# EAGLE design ASD2202 (EAGLE 6.3)
DATABASE: ./../../../../../Components/TinyCircuits_Part_Database.txt
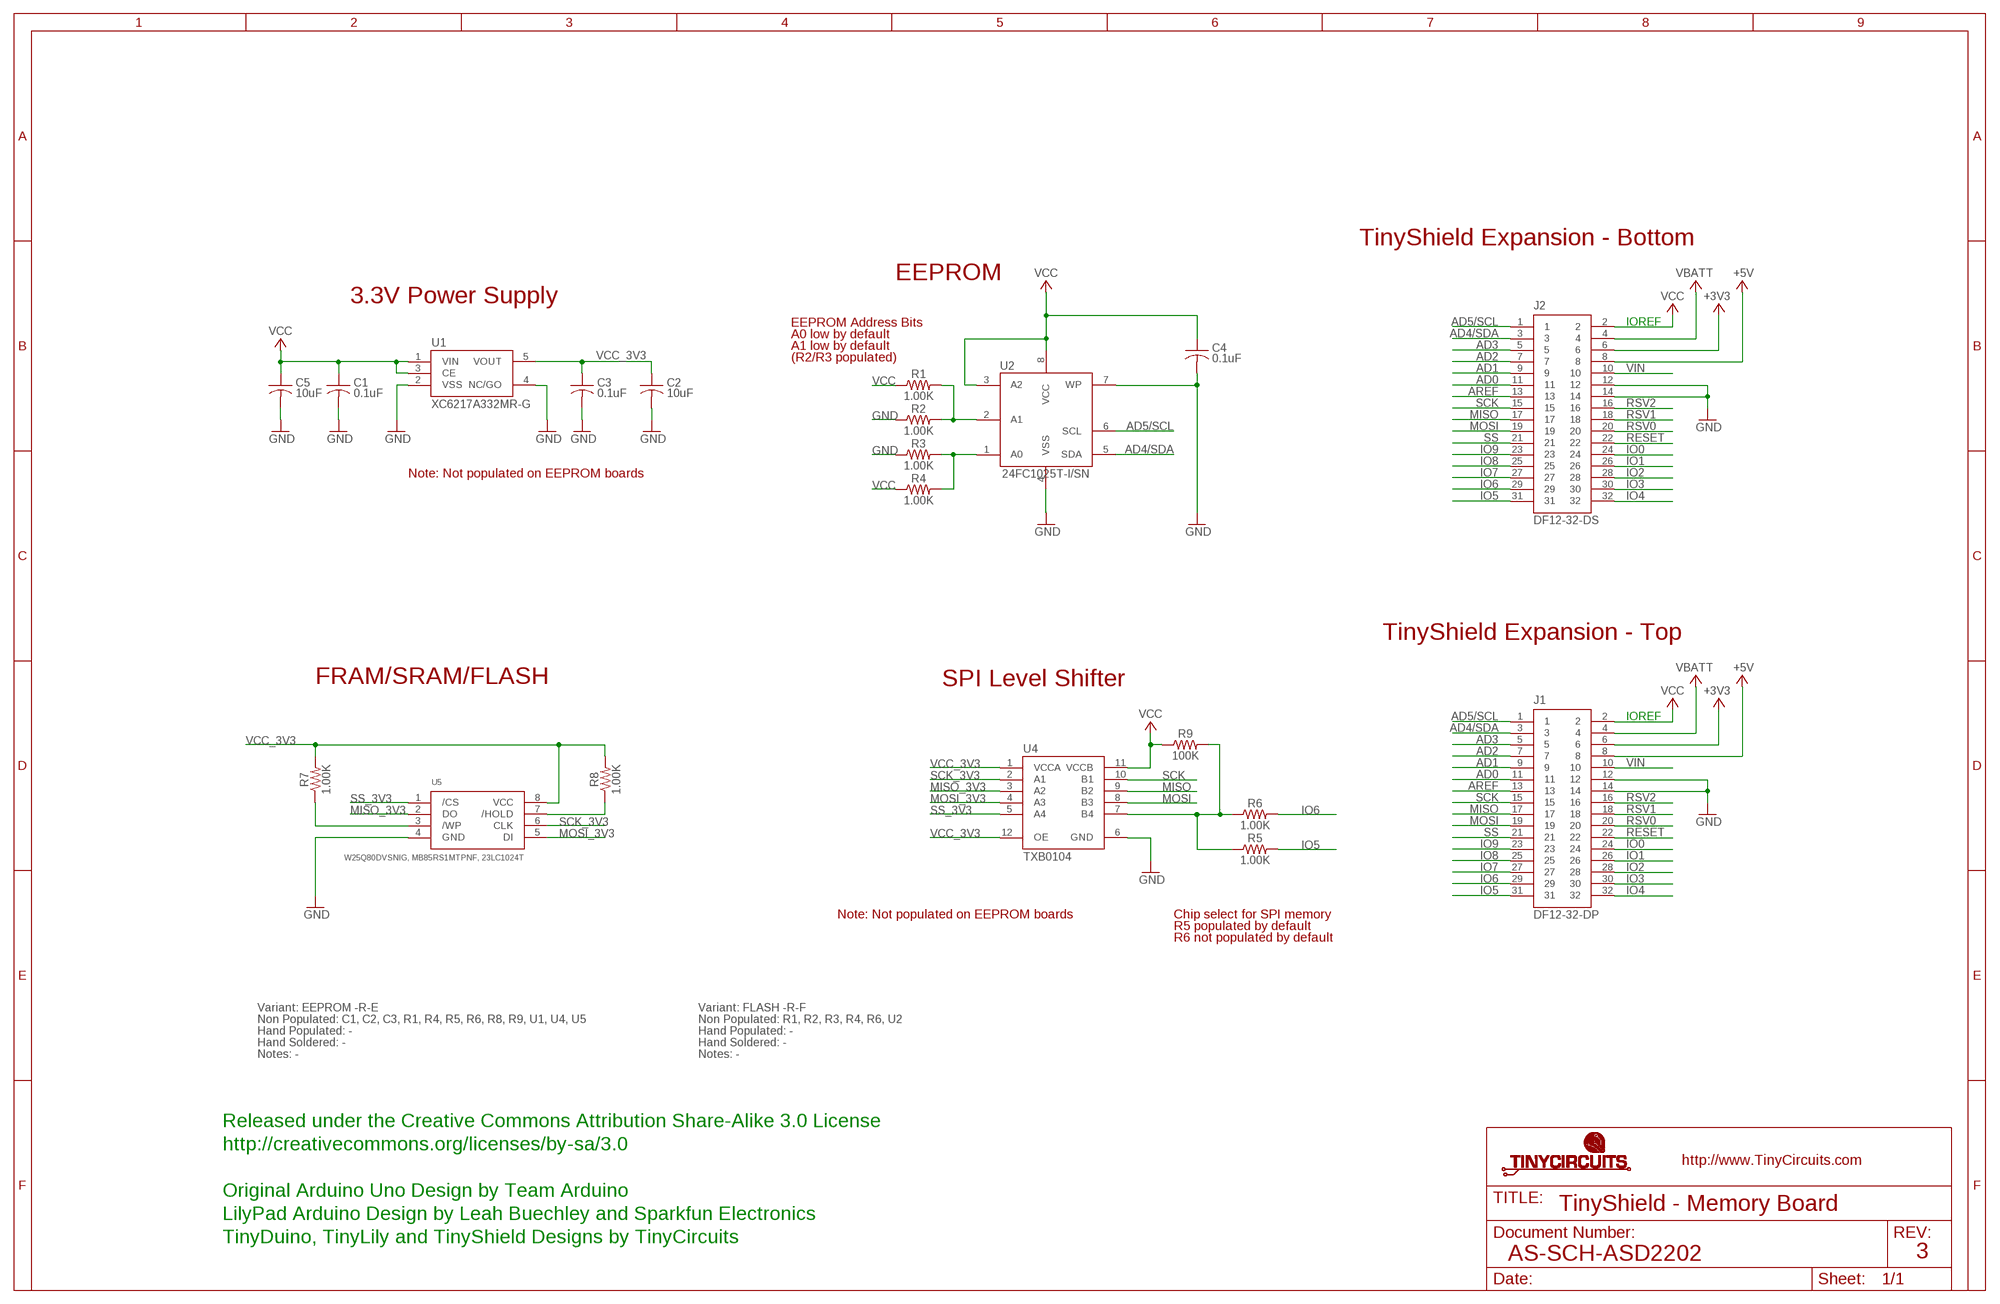
[diagram p0: schematic, sheet 1]

## Parts
C1  0.1uF  AS-ITM-00008  [C0402]
C2  10uF  AS-ITM-00045  [C0805]
C3  0.1uF  AS-ITM-00008  [C0402]
C4  0.1uF  AS-ITM-00008  [C0402]
C5  10uF  AS-ITM-00045  [C0805]
J1  DF12-32-DP  AS-ITM-00015  [DF12-32-DP]
J2  DF12-32-DS  AS-ITM-00012  [DF12-32-DS]
R1  1.00K  AS-ITM-00003  [0402]
R2  1.00K  AS-ITM-00003  [0402]
R3  1.00K  AS-ITM-00003  [0402]
R4  1.00K  AS-ITM-00003  [0402]
R5  1.00K  AS-ITM-00003  [0402]
R6  1.00K  AS-ITM-00003  [0402]
R7  1.00K  AS-ITM-00003  [0402]
R8  1.00K  AS-ITM-00003  [0402]
R9  100K  AS-ITM-00004  [0402]
U1  XC6217A332MR-G  AS-ITM-00249  [SOT-25]
U2  24FC1025T-I/SN  AS-ITM-00190  [8-SOIC-N]
U4  TXB0104  AS-ITM-00048  [UQFN-12]
U5  W25Q80DVSNIG, MB85RS1MTPNF, 23LC1024T  AS-ITM-00238  [8-SOIC-N]

## Nets
+3V3: J1.6 J2.6
+5V: J1.8 J2.8
AD0: J1.11 J2.11
AD1: J1.9 J2.9
AD2: J1.7 J2.7
AD3: J1.5 J2.5
AD4/SDA: J1.3 J2.3 U2.5(SDA)
AD5/SCL: J1.1 J2.1 U2.6(SCL)
AREF: J1.13 J2.13
GND: C1.2 C2.2 C3.2 C4.2 C5.2 J1.12 J1.14 J2.12 J2.14 R2.1 R3.1 U1.2(VSS) U1.4(NC/GO) U2.4(VSS) U2.7(WP) U4.6(GND) U5.4(GND)
IO0: J1.24 J2.24
IO1: J1.26 J2.26
IO2: J1.28 J2.28
IO3: J1.30 J2.30
IO4: J1.32 J2.32
IO5: J1.31 J2.31 R5.2
IO6: J1.29 J2.29 R6.2
IO7: J1.27 J2.27
IO8: J1.25 J2.25
IO9: J1.23 J2.23
MISO: J1.17 J2.17 U4.9(B2)
MISO_3V3: U4.3(A2) U5.2(DO)
MOSI: J1.19 J2.19 U4.8(B3)
MOSI_3V3: U4.4(A3) U5.5(DI)
N$1: R8.1 U5.7(/HOLD)
N$2: R7.1 U5.3(/WP)
N$3: R1.2 R2.2 U2.2(A1)
N$4: R3.2 R4.2 U2.1(A0)
N$7: R5.1 R6.1 R9.2 U4.7(B4)
RESET: J1.22 J2.22
RSV0: J1.20 J2.20
RSV1: J1.18 J2.18
RSV2: J1.16 J2.16
SCK: J1.15 J2.15 U4.10(B1)
SCK_3V3: U4.2(A1) U5.6(CLK)
SS: J1.21 J2.21
SS_3V3: U4.5(A4) U5.1(/CS)
VBATT: J1.4 J2.4
VCC: C1.1 C4.1 C5.1 J1.2 J2.2 R1.1 R4.1 R9.1 U1.1(VIN) U1.3(CE) U2.3(A2) U2.8(VCC) U4.11(VCCB)
VCC_3V3: C2.1 C3.1 R7.2 R8.2 U1.5(VOUT) U4.1(VCCA) U4.12(OE) U5.8(VCC)
VIN: J1.10 J2.10

## Notes on the sheet
- TinyShield Expansion - Bottom
- EEPROM
- 3.3V Power Supply
- EEPROM Address Bits | IOREF
- A0 low by default
- A1 low by default
- (R2/R3 populated)
- Note: Not populated on EEPROM boards
- TinyShield Expansion - Top
- FRAM/SRAM/FLASH | SPI Level Shifter
- IOREF
- Note: Not populated on EEPROM boards | Chip select for SPI memory
- R5 populated by default
- R6 not populated by default
- Variant: EEPROM -R-E | Variant: FLASH -R-F
- Non Populated: C1, C2, C3, R1, R4, R5, R6, R8, R9, U1, U4, U5 | Non Populated: R1, R2, R3, R4, R6, U2
- Hand Populated: - | Hand Populated: -
- Hand Soldered: - | Hand Soldered: -
- Notes: - | Notes: -
- Released under the Creative Commons Attribution Share-Alike 3.0 License
- http://creativecommons.org/licenses/by-sa/3.0
- Original Arduino Uno Design by Team Arduino
- TinyShield - Memory Board
- LilyPad Arduino Design by Leah Buechley and Sparkfun Electronics
- TinyDuino, TinyLily and TinyShield Designs by TinyCircuits
- AS-SCH-ASD2202 | 3

## Library data of the parts
C1 C3 C4 = tinycircuits:AS-ITM-00008: CAP CER 0.1UF 16V 10% X5R 0402; PARTNO: AS-ITM-00008
C2 C5 = tinycircuits:AS-ITM-00045: CAP CER 16UF 16V 20% X5R 0805; PARTNO: AS-ITM-00045
J1 = tinycircuits:AS-ITM-00015: CONN HEADER 32POS 3MM SMD 0.5MM; PARTNO: AS-ITM-00015
J2 = tinycircuits:AS-ITM-00012: CONN RECEPT 32POS 3MM SMD 0.5MM; PARTNO: AS-ITM-00012
R1-R8 = tinycircuits:AS-ITM-00003: RES 1.00K OHM 1/16W 1% 0402; PARTNO: AS-ITM-00003
R9 = tinycircuits:AS-ITM-00004: RES 100K OHM 1/16W 1% 0402; PARTNO: AS-ITM-00004
U1 = tinycircuits:AS-ITM-00249: IC REG LDO 3.3V 0.2A SOT25; PARTNO: AS-ITM-00249; PNPROTATION: 270; VALUE: XC6217A33
U2 = tinycircuits:AS-ITM-00190: IC EEPROM 1MBIT 1MHZ 8SOIC; PARTNO: AS-ITM-00190
U4 = tinycircuits:AS-ITM-00048: IC VOLT-LEVEL TRANSLATOR 12UQFN; PARTNO: AS-ITM-00048; PNPROTATION: 0
U5 = tinycircuits:AS-ITM-00238: SOIC 150MIL 4MBIT SERIAL FLASH SPI; PARTNO: AS-ITM-00238; PNPROTATION: 90; VALUE: W25Q40BVSNIG

## Board
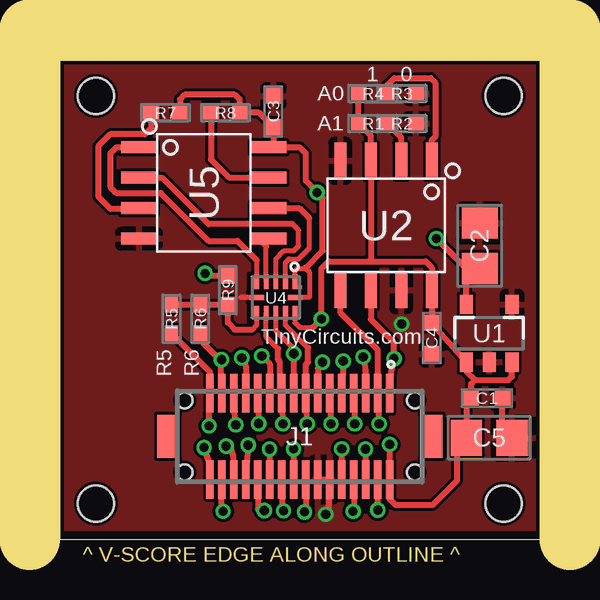
[diagram p1: board, top side]
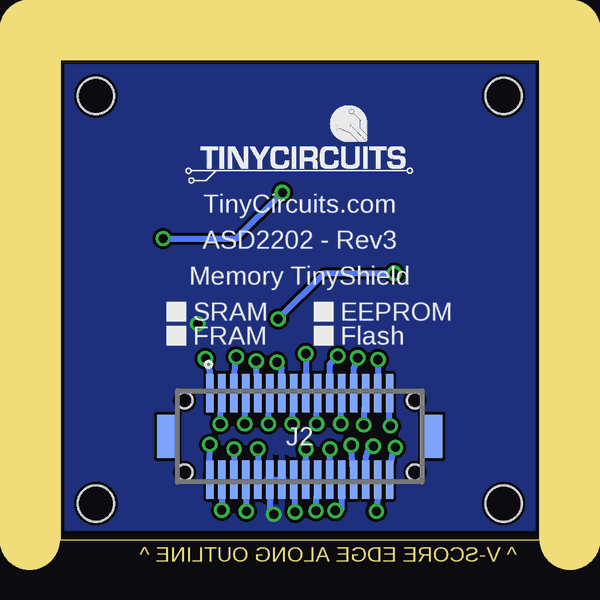
[diagram p2: board, bottom side, seen from below]

Size 20 x 20 mm. Coordinates in mm from the lower left corner, seen from the top.
Outline: 0,20 20,20 20,0 0,0 0,20
Copper layers (1*16): Top 0.035mm / dielectric 1.5mm / Bottom 0.035mm
Design rules "default *": minimum track width 5mil, minimum drill 15mil, track to track 5mil, track to pad 5mil, pad to pad 5mil, via to via 6mil, smd to smd 5mil, copper to edge 6mil, drill to drill 8mil, minimum pad ring 10mil, minimum via ring 5mil, stop-mask expansion 4mil, vias tented up to drill 25mil, thermal gap 10mil
Holes 1.5 mm at 1.5,18.5 18.5,18.5 18.5,1.5 1.5,1.5
tRestrict: area 7.9,9.9 to 8.9,10.4; 1 lines
bRestrict: 1 lines
Milling: 3 lines

### Footprints (pad centres in the part's own frame; a part is rotated, then mirrored left to right if it is on the bottom)
C0402 = smd 0.65 x 0.6: 1 -0.65,0; 2 0.65,0
C0805 = smd 1.3 x 1.5: 1 -0.95,0; 2 0.95,0
DF12-32-DP = smd 0.3 x 1.6: 1 -3.75,-1.8; 2 -3.75,1.8; 3 -3.25,-1.8; 4 -3.25,1.8; 5 -2.75,-1.8; 6 -2.75,1.8; 7 -2.25,-1.8; 8 -2.25,1.8; 9 -1.75,-1.8; 10 -1.75,1.8; 11 -1.25,-1.8; 12 -1.25,1.8; 13 -0.75,-1.8; 14 -0.75,1.8; 15 -0.25,-1.8; 16 -0.25,1.8; 17 0.25,-1.8; 18 0.25,1.8; 19 0.75,-1.8; 20 0.75,1.8; 21 1.25,-1.8; 22 1.25,1.8; 23 1.75,-1.8; 24 1.75,1.8; 25 2.25,-1.8; 26 2.25,1.8; 27 2.75,-1.8; 28 2.75,1.8; 29 3.25,-1.8; 30 3.25,1.8; 31 3.75,-1.8; 32 3.75,1.8 | smd 0.9 x 1.8: F1 -5.5,0; F2 5.5,0 | hole 0.65: -4.8,1.5; 4.8,1.5
DF12-32-DS = smd 0.3 x 1.6: 1 -3.75,1.8; 2 -3.75,-1.8; 3 -3.25,1.8; 4 -3.25,-1.8; 5 -2.75,1.8; 6 -2.75,-1.8; 7 -2.25,1.8; 8 -2.25,-1.8; 9 -1.75,1.8; 10 -1.75,-1.8; 11 -1.25,1.8; 12 -1.25,-1.8; 13 -0.75,1.8; 14 -0.75,-1.8; 15 -0.25,1.8; 16 -0.25,-1.8; 17 0.25,1.8; 18 0.25,-1.8; 19 0.75,1.8; 20 0.75,-1.8; 21 1.25,1.8; 22 1.25,-1.8; 23 1.75,1.8; 24 1.75,-1.8; 25 2.25,1.8; 26 2.25,-1.8; 27 2.75,1.8; 28 2.75,-1.8; 29 3.25,1.8; 30 3.25,-1.8; 31 3.75,1.8; 32 3.75,-1.8 | smd 0.9 x 1.8: F1 -5.5,0; F2 5.5,0 | hole 0.65: -4.8,1.5; 4.8,1.5
0402 = smd 0.65 x 0.55: 1 -0.6,0; 2 0.6,0
SOT-25 = smd 0.55 x 0.8: 1 -0.95,-1.2; 2 0,-1.2; 3 0.95,-1.2; 4 0.95,1.2; 5 -0.95,1.2
8-SOIC-N = smd 0.5 x 1.5: 1 -1.905,-2.7; 2 -0.635,-2.7; 3 0.635,-2.7; 4 1.905,-2.7; 5 1.905,2.7; 6 0.635,2.7; 7 -0.635,2.7; 8 -1.905,2.7
UQFN-12 = smd 0.2 x 0.6: 1 -0.8,-0.65; 2 -0.4,-0.65; 3 0,-0.65; 4 0.4,-0.65; 5 0.8,-0.65; 7 0.8,0.65; 8 0.4,0.65; 9 0,0.65; 10 -0.4,0.65; 11 -0.8,0.65 | smd 0.6 x 0.2: 6 0.8,0; 12 -0.8,0

### Placement (x,y rotation side)
C1  17.8,5.9 0 top
C2  17.5,12.25 90 top
C3  8.9,17.85 90 top
C4  15.5,8.4 270 top
C5  17.9,4.25 0 top
J1  10,4.3 180 top
J2  10,4.3 0 bottom
R1  13.05,17.35 0 top
R2  14.25,17.35 180 top
R3  14.25,18.6 180 top
R4  13.05,18.6 0 top
R5  4.65,9.2 270 top
R6  5.85,9.2 270 top
R7  4.4,17.8 0 top
R8  6.9,17.8 0 top
R9  7,10.4 270 top
U1  17.9,8.6 0 top
U2  13.6,13.1 180 top
U4  9,10.1 180 top
U5  6,14.45 270 top
U$1  [DOCFIELD-TINYCIRCUITS-PCB]  33.91,-10 0 top  (outside the outline)

### Tracks (layer width: path | path; a pad name or v marks a point on that pad's centre or on a via)
+3V3  (via drill 0.38)
  Top 0.254: J2.6 v12.75,3.77 v12.74,3.77
  Bottom 0.254: v12.74,3.77 12.74,2.51 J2.6
+5V  (via drill 0.38)
  Top 0.254: J2.8 12.25,1.2 v12.23,1.18
  Bottom 0.254: v12.23,1.18 12.23,2.47 J2.8
AD0  (via drill 0.38)
  Top 0.254: v11.3,4.83 11.31,5.05 J2.11
  Bottom 0.254: J2.11 11.28,5.79 v11.3,4.83
AD1  (via drill 0.38)
  Top 0.254: J2.9 11.79,6.27 v11.81,7.44
  Bottom 0.254: v11.81,7.44 11.78,6.22 J2.9
AD2  (via drill 0.38)
  Top 0.254: v12.29,4.83 12.31,5.05 J2.7
  Bottom 0.254: J2.7 12.27,5.86 v12.29,4.83
AD3  (via drill 0.38)
  Top 0.254: J2.5 12.73,7.04 v12.65,7.61
  Bottom 0.254: v12.65,7.61 12.78,6.3 J2.5
AD4/SDA  (via drill 0.38)
  Top 0.254: v13.31,4.83 13.31,5 J2.3 13.25,7.9 11.7,9.45 U2.5
  Bottom 0.254: J2.3 13.28,5.86 v13.31,4.83
AD5/SCL  (via drill 0.38)
  Top 0.254: J2.1 13.78,6.23 13.78,6.81 13.81,7 v13.93,7.55 13.9,7.58 13.9,8.25 12.96,9.18 U2.6
  Bottom 0.254: J2.1 13.75,7.01 v13.93,7.55
AREF  (via drill 0.38)
  Top 0.254: J2.13 10.75,7.15 v10.95,7.4
  Bottom 0.254: v10.95,7.4 10.76,7.14 J2.13
GND  (via drill 0.38)
  Top 0.203: U4.6 7.55,10.1
  Top 0.254: J2.14 J2.12 11.21,2.46 11.21,1.18 v11.08,1.05 | U1.4 18.9,9.9 | C5.2 18.45,4.65 C1.2
  Bottom 0.254: J2.14 J2.12 11.25,1.22 v11.08,1.05
  other vias: 14.25,8.99
  pour Bottom: 0.16,19.84 19.84,19.84 19.84,0.16 0.16,0.16
  pour Top: 0.16,19.84 19.84,19.84 19.84,0.16 0.16,0.16
IO0  (via drill 0.38)
  Top 0.254: J2.24 8.25,1.26 v8.52,1.21
  Bottom 0.254: J2.24 8.25,1.27 8.48,1.27 v8.52,1.21
IO1  (via drill 0.38)
  Top 0.254: v7.85,3.94 J2.26
  Bottom 0.254: 7.85,3.66 J2.26 v7.85,3.94
IO2  (via drill 0.38)
  Top 0.254: v6.93,3.89 7.07,3.89 7.22,3.49 7.29,2.61 7.26,2.51 J2.28
  Bottom 0.254: J2.28 7.24,3.43 7.07,3.88 v6.93,3.89
IO3  (via drill 0.38)
  Top 0.254: J2.30 6.73,1.54 v6.81,1.18
  Bottom 0.254: v6.81,1.18 6.75,1.66 6.77,2.53 J2.30
IO4  (via drill 0.38)
  Top 0.254: J2.32 6.25,3.14 v6.02,3.84
  Bottom 0.254: v6.02,3.84 6.11,3.71 6.21,3.18 6.21,3.14 6.26,3.1 J2.32
IO5  (via drill 0.38)
  Top 0.254: v6.22,4.74 6.23,5.08 J2.31 6.25,7 R5.2
  Bottom 0.254: J2.31 6.26,5.09 v6.22,4.74
IO6  (via drill 0.38)
  Top 0.254: J2.29 6.7,7.42 6.61,7.4 6.63,7.52 | 6.63,7.52 v6.73,7.5 | 6.63,7.52 5.9,8.25 R6.2
  Bottom 0.254: v6.73,7.5 6.74,6.11 J2.29
IO7  (via drill 0.38)
  Top 0.254: v7.33,4.78 7.31,4.9 J2.27
  Bottom 0.254: J2.27 7.29,5.76 v7.33,4.78
IO8  (via drill 0.38)
  Top 0.254: 7.76,6.11 J2.25 7.75,7.14 7.68,7.52 v7.58,7.58
  Bottom 0.254: J2.25 7.75,7.14 v7.58,7.58
IO9  (via drill 0.38)
  Top 0.254: v8.29,4.83 8.31,4.98 J2.23
  Bottom 0.254: J2.23 8.28,5.59 v8.29,4.83
MISO  (via drill 0.38)
  Top 0.203: 9.75,7.95 9,8.7 U4.9
  Top 0.254: J2.17 v9.75,7.75 9.75,7.95
  Bottom 0.254: 9.81,6.16 J2.17 v9.75,7.75
MISO_3V3
  Top 0.203: U4.3 9,11.7 9.35,12.05 9.75,12.05 9.95,12.25 9.95,12.9 9.7,13.15
  Top 0.254: 9.7,13.15 6.2,13.15 4.28,15.07 | 4.28,15.07 3.35,15.1 3.25,15.05 | U5.2 3.47,15.09 4.28,15.07
MOSI  (via drill 0.38)
  Top 0.203: 9.1,7.95 8.6,8.45 U4.8
  Top 0.254: v9.3,4.83 9.31,4.95 J2.19 9.18,6.15 9.18,7.42 9.1,7.5 9.1,7.95
  Bottom 0.254: v9.3,4.83 9.27,5.76 J2.19 9.18,6.15
MOSI_3V3
  Top 0.203: U4.4 8.6,12.23
  Top 0.254: U5.5 8.3,12.53 8.6,12.23
N$1
  Top 0.254: R8.1 6.3,15.85 7.05,15.1 8.32,15.1 | 8.88,15.1 8.32,15.1 | 8.32,15.1 U5.7
N$2
  Top 0.254: R7.1 3.8,17.15 3.55,16.9 2.1,16.9 1.6,16.4 1.6,14.3 2.1,13.8 3.29,13.8 U5.3
N$3
  Top 0.254: U2.2 14.23,16.77 R1.2
N$4
  Top 0.254: U2.1 15.5,16.66 15.65,16.8 15.65,19.05 15.45,19.25 13.95,19.25 13.65,18.95 R4.2
N$7
  Top 0.203: U4.7 8.2,8.95 8,8.75
  Top 0.254: R5.1 R6.1 R9.2 7,9.05 7.3,8.75 8,8.75
RESET  (via drill 0.38)
  Top 0.254: v8.74,3.77 J2.22
  Bottom 0.254: J2.22 8.75,3.69 v8.74,3.77
RSV0  (via drill 0.38)
  Top 0.254: J2.20 9.25,1.2 v9.32,1.2
  Bottom 0.254: v9.32,1.2 J2.20
RSV1  (via drill 0.38)
  Top 0.254: v9.74,3.77 9.74,2.51 J2.18
  Bottom 0.254: J2.18 9.75,3.72 v9.74,3.77
RSV2  (via drill 0.38)
  Top 0.254: J2.16 10.25,1.11 v10.19,1.15
  Bottom 0.254: v10.19,1.15 10.19,2.44 J2.16
SCK  (via drill 0.38)
  Top 0.203: 10.35,8 9.4,8.95 U4.10
  Top 0.254: v10.31,4.83 10.31,4.98 J2.15 10.25,7.3 10.35,7.4 10.35,8
  Bottom 0.254: J2.15 10.29,5.66 v10.31,4.83
SCK_3V3
  Top 0.203: U4.2 9.4,11.55 9.55,11.7 9.95,11.7 10.4,12.15 10.4,13.4
  Top 0.254: 10.4,13.4 10,13.8 8.93,13.8 8.91,13.82 U5.6
SS  (via drill 0.38)
  Top 0.254: 8.77,6.12 J2.21 8.75,7.32 v8.41,7.65
  Bottom 0.254: J2.21 8.75,7.32 v8.41,7.65
SS_3V3
  Top 0.203: 8.2,11.65 U4.5
  Top 0.254: 8.2,11.65 7.4,12.45 6.2,12.45 4.2,14.45 2.35,14.45 2.1,14.7 2.1,16.1 2.36,16.36 2.9,16.36 U5.1
VBATT  (via drill 0.38)
  Top 0.254: v13.25,1.23 J2.4
  Bottom 0.254: J2.4 13.25,1.24 v13.25,1.23
VCC  (via drill 0.38)
  Top 0.203: U4.11 9.8,9.05 10,8.85 10.55,8.85
  Top 0.254: v13.75,3.97 13.73,2.67 J2.2 13.75,1.68 14,1.43 15.53,1.43 16.54,2.45 16.54,3.83 C5.1 16.96,5.63 C1.1 17.15,6.5 17.3,6.65 | C4.1 U2.8 15.5,11.35 15.25,11.6 13.05,11.6 | C4.1 15.5,9.02 U1.1 16.95,7 17.3,6.65 | 10.55,8.85 v10.9,9.2 10.9,11.3 11.2,11.6 13.05,11.6 | 17.3,6.65 18.7,6.65 18.85,6.8 U1.3 | 13.05,11.6 12.96,11.68 U2.3 12.96,16.84 R1.1 R4.1 | R9.1 6.15,11 v6.05,11.1 | C4.1
  Bottom 0.254: J2.2 13.77,2.45 v13.75,3.97 | v6.05,11.1 9,11.1 v10.9,9.2
VCC_3V3  (via drill 0.38)
  Top 0.203: U4.1 9.8,11.2 9.9,11.3 10.25,11.3 10.4,11.15 10.4,10.1 U4.12
  Top 0.254: 10.25,11.3 10.25,11.35 10.95,12.05 10.95,14.25 v10.73,14.48 10.25,14.95 10.25,16.1 10,16.36 U5.8 8.9,16.55 C3.1 8.3,17.8 R8.2 7.5,18.35 7.3,18.55 5.2,18.55 5,18.35 R7.2 | U1.5 16.95,11.15 C2.1 16.95,11.3 v15.7,12.55
  Bottom 0.254: v15.7,12.55 12.65,12.55 v10.73,14.48
VIN  (via drill 0.38)
  Top 0.254: J2.10 v11.76,3.78 v11.75,3.78
  Bottom 0.254: v11.75,3.78 J2.10

### Text on the board
Dimension: ^ V-SCORE EDGE ALONG OUTLINE ^
tPlace: 1 | 0 | A0 | A1 | TinyCircuits.com | R5 | R6
bPlace: TinyCircuits.com | ASD2202 - Rev3 | Memory TinyShield | EEPROM | SRAM | Flash | FRAM
Document: FABRICATION DRAWING | NOTES: | 1. PRINTED CIRCUIT BOARD MADE FROM NEMA GRADE FR-4 EPOXY LAMINATE | WITH 1 OUNCE COPPER PLATING AND .024 THICKNESS. | 2. ALL DIMENSIONS ARE GIVEN IN INCHES. | 3. CIRCUIT PATHS ARE FOR REFERENCE ONLY. | 4. HOLE SIZES SHOWN ARE FINISHED DIAMETERS AFTER PLATING. | 5. BOARD PLATED USING REFLOW OR SIMILAR METHOD. | 6. BOARD TO HAVE BLUE SOLDER MASK ON PLATED SURFACES USING WET FILM | 7. SILKSCREEN BOARD USING WHITE INK. | SR100 OR SR1010 EPOXY. EQUIVALENT WET OR DRY FILM MAY BE USED. | 8. THE FOLLOWING INFORMATION APPLIES TO THIS BOARD: | * 2 COPPER LAYERS | * .024 BOARD THICKNESS | * REQUIRES TOP SIDE SILKSCREEN | Released under the Creative Commons Attribution Share-Alike 3.0 License | http://creativecommons.org/licenses/by-sa/3.0 | Original Arduino Uno Design by Team Arduino | LilyPad Arduino Design by Leah Buechley and Sparkfun Electronics | TinyDuino, TinyLily and TinyShield Designs by TinyCircuits | TinyShield - Memory Board | AS-PCB-ASD2202 | 3